# Altium schematic sheet [18] - DOC, POWER SEQUENCING.SchDoc
size A3; DocumentNumber: 2; SheetNumber: 18; SheetTotal: 20
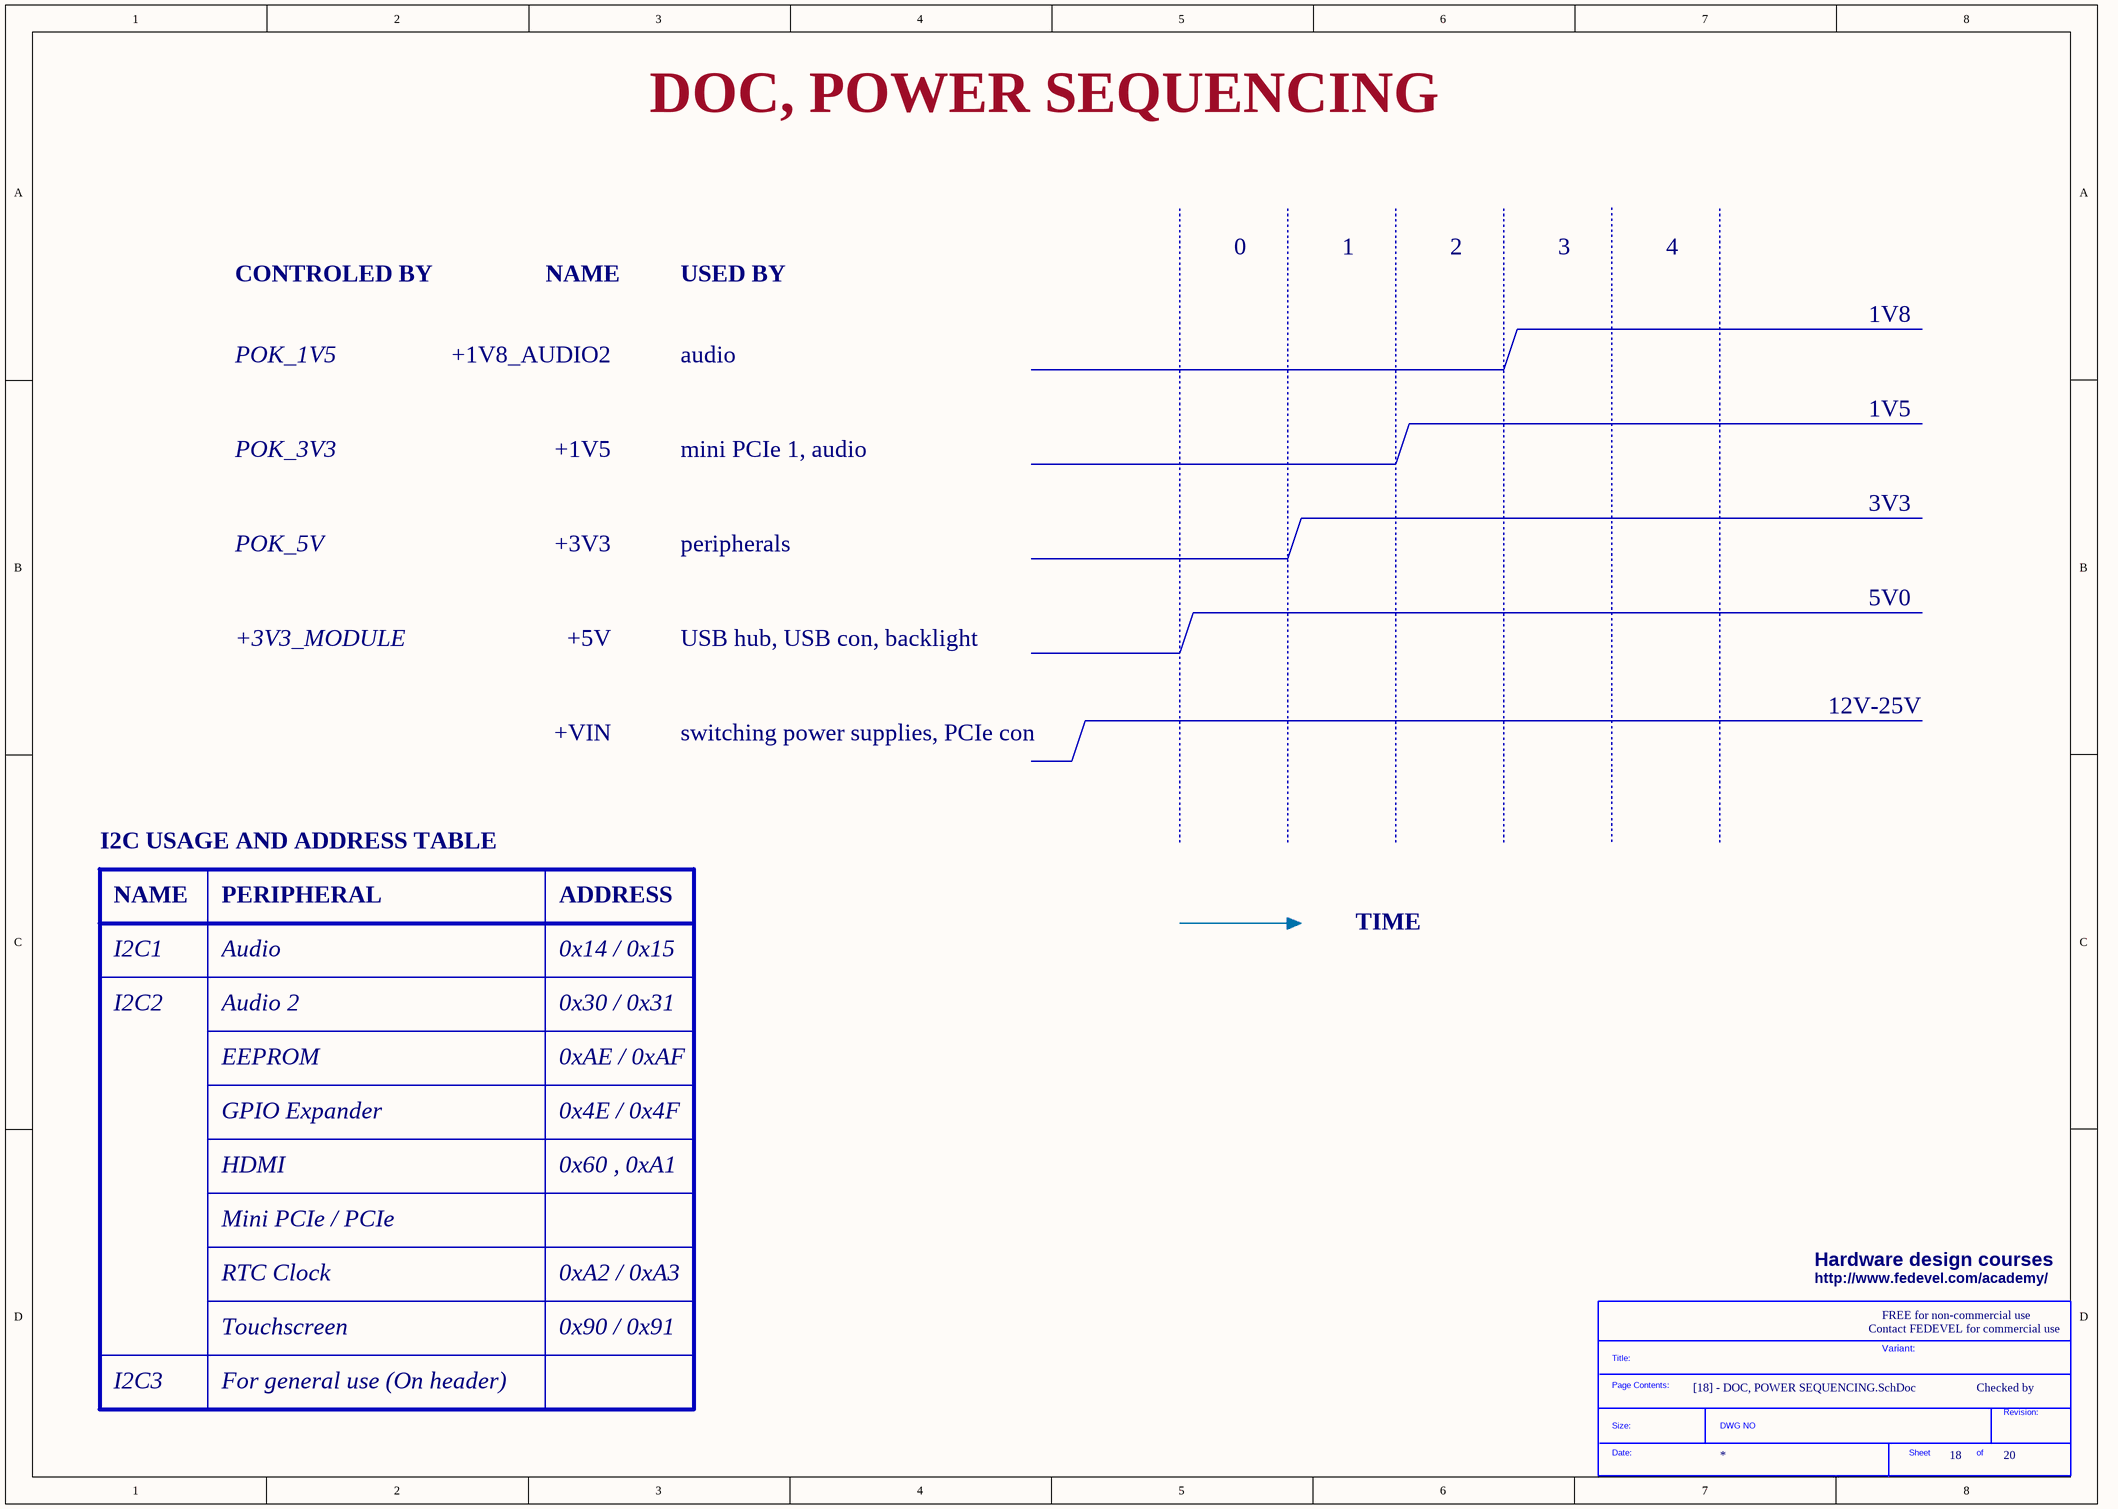
[diagram p0: [18] - DOC, POWER SEQUENCING.SchDoc]

## Parts
*  SDTitleBlock  (value not drawn)  (graphical)

## Notes on the sheet
- DOC, POWER SEQUENCING
- CONTROLED BY
- NAME
- USED BY
- 0
- 1
- 2
- 3
- 4
- POK_1V5
- +1V8_AUDIO2
- audio
- 1V8
- 1V5
- POK_3V3
- +1V5
- mini PCIe 1, audio
- 3V3
- POK_5V
- +3V3
- peripherals
- +3V3_MODULE
- +5V
- USB hub, USB con, backlight
- 5V0
- 12V-25V
- +VIN
- switching power supplies, PCIe con
- I2C USAGE AND ADDRESS TABLE
- PERIPHERAL
- ADDRESS
- I2C1
- Audio
- 0x14 / 0x15
- TIME
- I2C2
- Audio 2
- 0x30 / 0x31
- EEPROM
- GPIO Expander
- 0xAE / 0xAF
- 0x4E / 0x4F
- HDMI
- 0x60 , 0xA1
- Mini PCIe / PCIe
- Hardware design courses
- RTC Clock
- 0xA2 / 0xA3
- http://www.fedevel.com/academy/
- Contact FEDEVEL for commercial use
- FREE for non-commercial use
- I2C3
- For general use (On header)
- Touchscreen
- 0x90 / 0x91
- Variant:
- Checked by
- (in symbol SDTitleBlock) Title:; Page Contents:; Revision:; Size:; DWG NO; Date:; Sheet; of